# EAGLE design ConnectorBoard_no_opto (EAGLE 5.11)
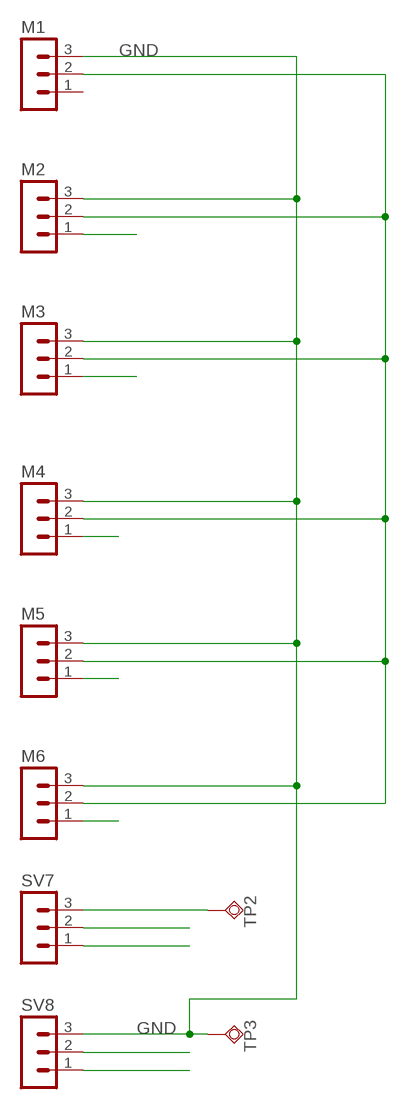
[diagram p0: schematic, sheet 1]

## Parts
M1  MA03-1  [MA03-1]
M2  MA03-1  [MA03-1]
M3  MA03-1  [MA03-1]
M4  MA03-1  [MA03-1]
M5  MA03-1  [MA03-1]
M6  MA03-1  [MA03-1]
SV7  MA03-1  [MA03-1]
SV8  MA03-1  [MA03-1]
TP2  TPSQTP14SQ  [TP14SQ]
TP3  TPSQTP14SQ  [TP14SQ]

## Nets
GND [pwr]: M1.3 M2.3 M3.3 M4.3 M5.3 M6.3 SV8.3 TP3.TP
N$1: M1.2 M2.2 M3.2 M4.2 M5.2 M6.2
N$3: M2.1
N$4: M3.1
N$6: M4.1
N$8: M5.1
N$9: SV8.1
N$11: M6.1
N$12 [pwr]: SV7.3 TP2.TP
N$13: SV8.2
N$14: SV7.2
N$15: SV7.1
Unconnected: M1.1

## Library data of the parts
M1-M6 SV7 SV8 = Fabian:MA03-1: PIN HEADER
TP2 TP3 = testpad:TPSQ: Test pad

## Net classes
0 default: width 0.4 mm
1 pwr: width 0.4 mm, clearance 0.3 mm

## Board
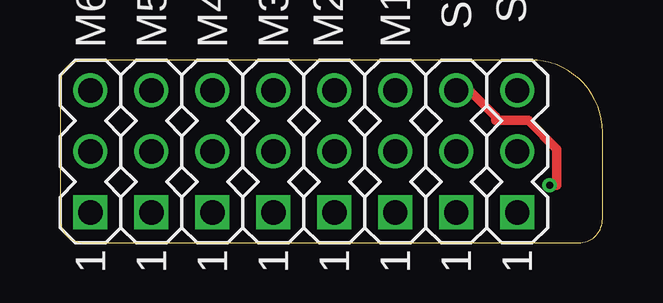
[diagram p1: board, top side]
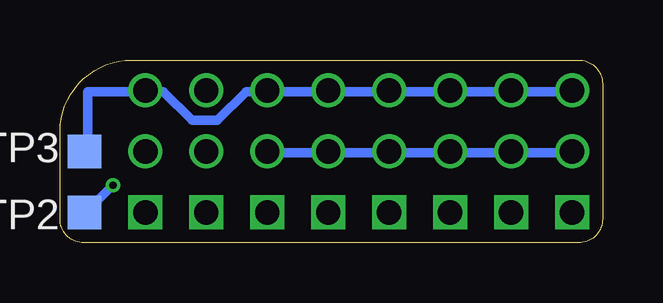
[diagram p2: board, bottom side, seen from below]

Size 22.61 x 7.62 mm. Coordinates in mm from the lower left corner, seen from the top.
Outline: 21.61,0 arc90 22.61,1 22.61,4.62 arc90 19.61,7.62 1,7.62 arc90 0,6.62 0,1 arc90 1,0 21.61,0
Copper layers (1*16): Top 0.035mm / dielectric 1.5mm / Bottom 0.035mm
Design rules "Fischer-LP_BGA *": minimum track width 0.3mm, minimum drill 0.3mm, track to track 0.15mm, track to pad 0.15mm, pad to pad 0.15mm, via to via 0.15mm, smd to smd 0mil, copper to edge 0.2mm, drill to drill 0.3mm, minimum pad ring 0.2mm, minimum via ring 0.15mm, stop-mask expansion 0.05mm, vias tented up to drill 0.5mm, thermal gap 0.15mm

### Footprints (pad centres in the part's own frame; a part is rotated, then mirrored left to right if it is on the bottom)
MA03-1 = drill 1.016 square: 1 -2.54,0 | drill 1.016 round: 2 0,0; 3 2.54,0
TP14SQ = smd 1.4 x 1.4: TP 0,0

### Placement (x,y rotation side)
M1  13.97,3.81 90 top
M2  11.43,3.81 90 top
M3  8.89,3.81 90 top
M4  6.35,3.81 90 top
M5  3.81,3.81 90 top
M6  1.27,3.81 90 top
SV7  16.51,3.81 90 top
SV8  19.05,3.81 90 top
TP2  21.59,1.27 0 bottom
TP3  21.59,3.81 0 bottom

### Tracks (layer width: path | path; a pad name or v marks a point on that pad's centre or on a via)
GND
  Bottom 0.4: TP3.TP 21.45,3.9 21.45,6.3 19.05,6.3 SV8.3 18.9,6.3 18.3,6.3 17.1,5.1 16.05,5.1 14.85,6.3 14.1,6.3 M1.3 13.95,6.3 11.55,6.3 M2.3 11.4,6.3 9,6.3 M3.3 8.85,6.3 6.45,6.3 M4.3 6.3,6.3 3.9,6.3 M5.3 3.75,6.3 1.35,6.3 M6.3
N$1
  Bottom 0.4: M6.2 1.35,3.75 3.75,3.75 M5.2 3.9,3.75 6.3,3.75 M4.2 6.45,3.75 8.85,3.75 M3.2 9,3.75 11.4,3.75 M2.2 11.55,3.75 13.95,3.75 M1.2
N$12  (via drill 0.3)
  Top 0.4: v20.4,2.4 20.7,2.4 20.7,3.9 19.5,5.1 18.15,5.1 18.15,5.25 16.65,6.75 16.5,6.75 16.5,6.45 SV7.3
  Bottom 0.4: v20.4,2.4 21.45,1.35 TP2.TP

### Text on the board
Document: gnd | s2 | gnd | plus | s3 | plus | sig | s4 | s1